# EAGLE schematic BatteryCharger(I2C_V1) (EAGLE 6.5.0)
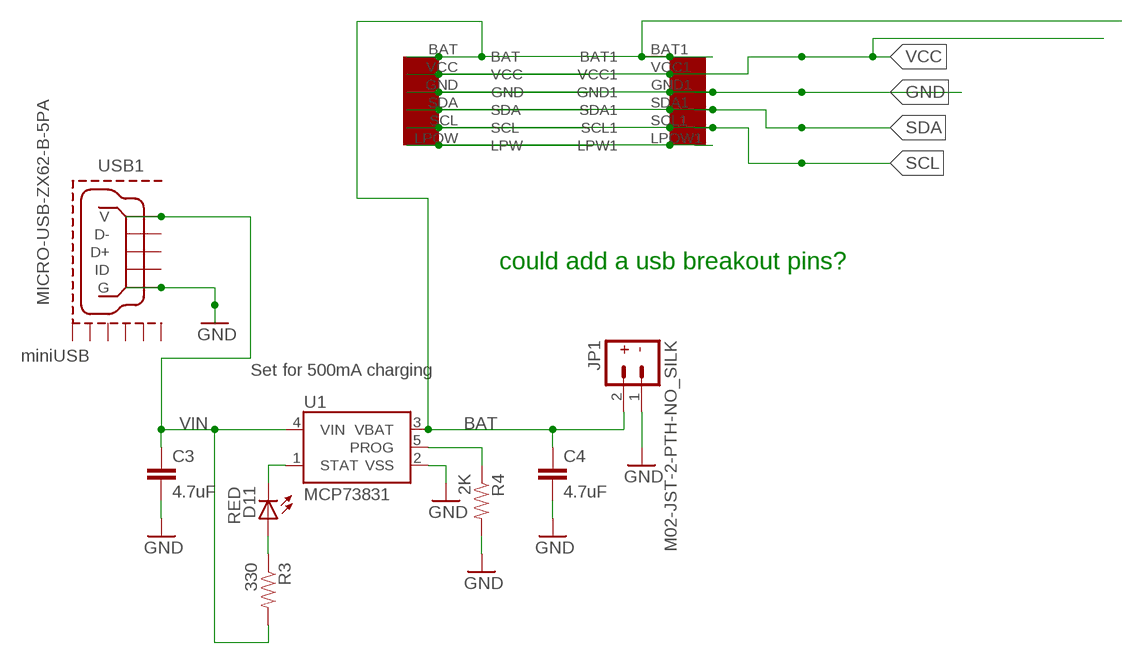
[diagram p0: schematic, sheet 1]

## Parts
C3  4.7uF  CAP0402-CAP  [0402-CAP]
C4  4.7uF  CAP0402-CAP  [0402-CAP]
D11  RED  LED0603  [LED-0603]
JP1  M02-JST-2-PTH-NO_SILK  [JST-2-PTH-NS]
R3  330  RESISTOR0402-RES  [0402-RES]
R4  2K  RESISTOR0402-RES  [0402-RES]
U1  MCP73831  [SOT23-5]
U$1  EZ-I2CHEADERV1  [EZ-I2CHEADERV1]
USB1  MICRO-USB-ZX62-B-5PA  [ZX62-B-5PA]

## Nets
BAT: C4.1 JP1.2 U1.3(VBAT) U$1.BAT U$1.BAT1
GND: C3.2 C4.2 JP1.1 R4.2 U1.2(VSS) U$1.GND U$1.GND1 USB1.5(G)
N$2: D11.A R3.1
N$3: U$1.LPOW1(LPW1) U$1.LPOW(LPW)
PROG: R4.1 U1.5(PROG)
SCL: U$1.SCL U$1.SCL1
SDA: U$1.SDA U$1.SDA1
STAT: D11.C U1.1(STAT)
VCC: U$1.VCC U$1.VCC1
VIN: C3.1 R3.2 U1.4(VIN) USB1.1(V)
Unconnected: USB1.2(D-) USB1.3(D+) USB1.4(ID)

## Notes on the sheet
- could add a usb breakout pins?
- miniUSB
- Set for 500mA charging

## Power pins joined to a net without a drawn wire
GND1: USB1.GND@1(GND1)
GND2: USB1.GND@2(GND2)
GND3: USB1.GND@3(GND3)
GND4: USB1.GND@4(GND4)
GND5: USB1.GND@5(GND5)
GND6: USB1.GND@6(GND6)

## Library data of the parts
C3 C4 = SparkFun:CAP: Capacitor Standard 0603 ceramic capacitor, and 0.1" leaded capacitor.
D11 = SparkFun:LED: LEDs Standard schematic elements and footprints for 5mm, 3mm, 1206, and 0603 sized LEDs. 5mm - Spark Fun Electronics SKU : COM-00529 (and others)
JP1 = SparkFun-Connectors:M02: Standard 2-pin 0.1" header. Use with - straight break away headers ( PRT-00116) - right angle break away headers (PRT-00553) - swiss pins (PRT-00743) - machine pins (PRT-00117) - female headers (PRT-00115) Molex polarized connector foot print use with: PRT-08233 with associated crimp pins and housings. 2.54_SCREWTERM for use with PRT-10571. 3.5mm Screw Terminal footprints for PRT-08084 5mm Screw Terminal footprints for use with PRT-08433
R3 R4 = SparkFun:RESISTOR: Resistor Basic schematic elements and footprints for 0603, 1206, and PTH resistors.
U1 = SparkFun:MCP73831: Microchip's MCP73831 Miniature single cell, fully integrated Li-Ion, Li-polymer charge management controller http://ww1.microchip.com/downloads/en/DeviceDoc/21984a.pdf
U$1 = UniqueInteractionsLib:EZ-I2CHEADERV1
USB1 = serial:MICRO-USB: MICRO USB B, BOTTOM MOUNT